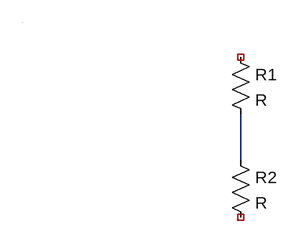
[diagram p0: schematic Draft1.asc]
Draft1.asc, the LTspice schematic file:
Version 4
SHEET 1 880 680
WIRE 304 192 304 128
WIRE 0 0 0 0
SYMBOL res 288 32 R0
SYMATTR InstName R1
SYMBOL res 288 176 R0
SYMATTR InstName R2

The netlist it stands for:
* Draft1.asc
R1 NC_01 N001 R
R2 N001 NC_02 R
.backanno
.end